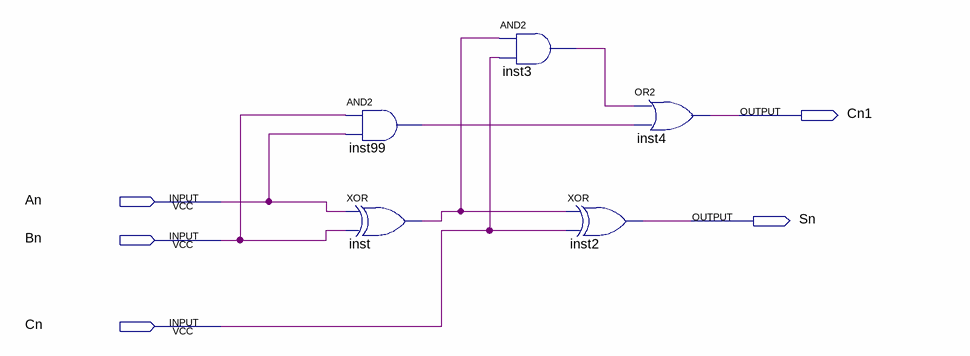
[diagram p0: schematic sheet]
// Quartus schematic Somador.bdf as structural Verilog: 5 symbols, 5 pins
module Somador (
  input  An,
  input  Bn,
  input  Cn,
  output Cn1,
  output Sn
);

  wire inst3_out, inst99_out, inst_out;

  and inst99 (inst99_out, Bn, An);
  xor inst (inst_out, An, Bn);
  and inst3 (inst3_out, inst_out, Cn);
  xor inst2 (Sn, inst_out, Cn);
  or inst4 (Cn1, inst3_out, inst99_out);
endmodule
